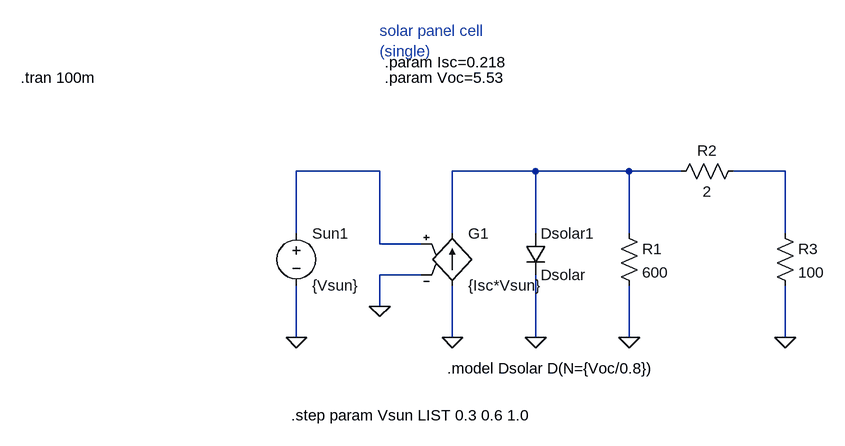
[diagram p0: schematic solar cell.asc]
solar cell.asc, the LTspice schematic file:
Version 4
SHEET 1 880 680
WIRE 0 240 -128 240
WIRE 240 240 112 240
WIRE 384 240 240 240
WIRE 464 240 384 240
WIRE 624 240 544 240
WIRE -128 336 -128 240
WIRE 112 336 112 240
WIRE 240 336 240 240
WIRE 384 336 384 240
WIRE 624 336 624 240
WIRE 0 352 0 240
WIRE 64 352 0 352
WIRE 64 400 0 400
WIRE 0 448 0 400
WIRE -128 496 -128 416
WIRE 112 496 112 416
WIRE 240 496 240 400
WIRE 384 496 384 416
WIRE 624 496 624 416
FLAG -128 496 0
FLAG 240 496 0
FLAG 384 496 0
FLAG 112 496 0
FLAG 0 448 0
FLAG 624 496 0
SYMBOL voltage -128 320 R0
SYMATTR InstName Sun1
SYMATTR Value {Vsun}
SYMBOL Diode 224 336 R0
SYMATTR InstName Dsolar1
SYMATTR Value Dsolar
SYMBOL Res 368 320 R0
SYMATTR InstName R1
SYMATTR Value 600
SYMBOL Res 560 224 R90
WINDOW 0 0 56 VBottom 2
WINDOW 3 32 56 VTop 2
SYMATTR InstName R2
SYMATTR Value 2
SYMBOL g 112 320 R0
SYMATTR InstName G1
SYMATTR Value {Isc*Vsun}
SYMBOL Res 608 320 R0
SYMATTR InstName R3
SYMATTR Value 100
TEXT 0 24 Left 2 ;solar panel cell\n(single)
TEXT -136 616 Left 2 !.step param Vsun LIST 0.3 0.6 1.0
TEXT 104 544 Left 2 !.model Dsolar D(N={Voc/0.8})
TEXT 8 72 Left 2 !.param Isc=0.218
TEXT 8 96 Left 2 !.param Voc=5.53
TEXT -552 96 Left 2 !.tran 100m

The netlist it stands for:
* solar cell.asc
V§Sun1 N001 0 {Vsun}
Dsolar1 N002 0 Dsolar
R1 N002 0 600
R2 N003 N002 2
G1 0 N002 N001 0 {Isc*Vsun}
R3 N003 0 100
.model D D
.lib standard.dio
* solar panel cell
* (single)
.step param Vsun LIST 0.3 0.6 1.0
.model Dsolar D(N={Voc/0.8})
.param Isc=0.218
.param Voc=5.53
.tran 100m
.backanno
.end